# EasyEDA Pro project PCB工程文件(使用专业版立创EDA导入).epro

# Schematic rydog
Board Name: RYDOG; Create Date: 2024-09-16; Page Name: P1; Project Name: RY-DOG V2.0; Schematic Name: rydog; Update Date: 2024-10-09; Company: 嘉立创EDA; Page Size: A3; Version: V2.0
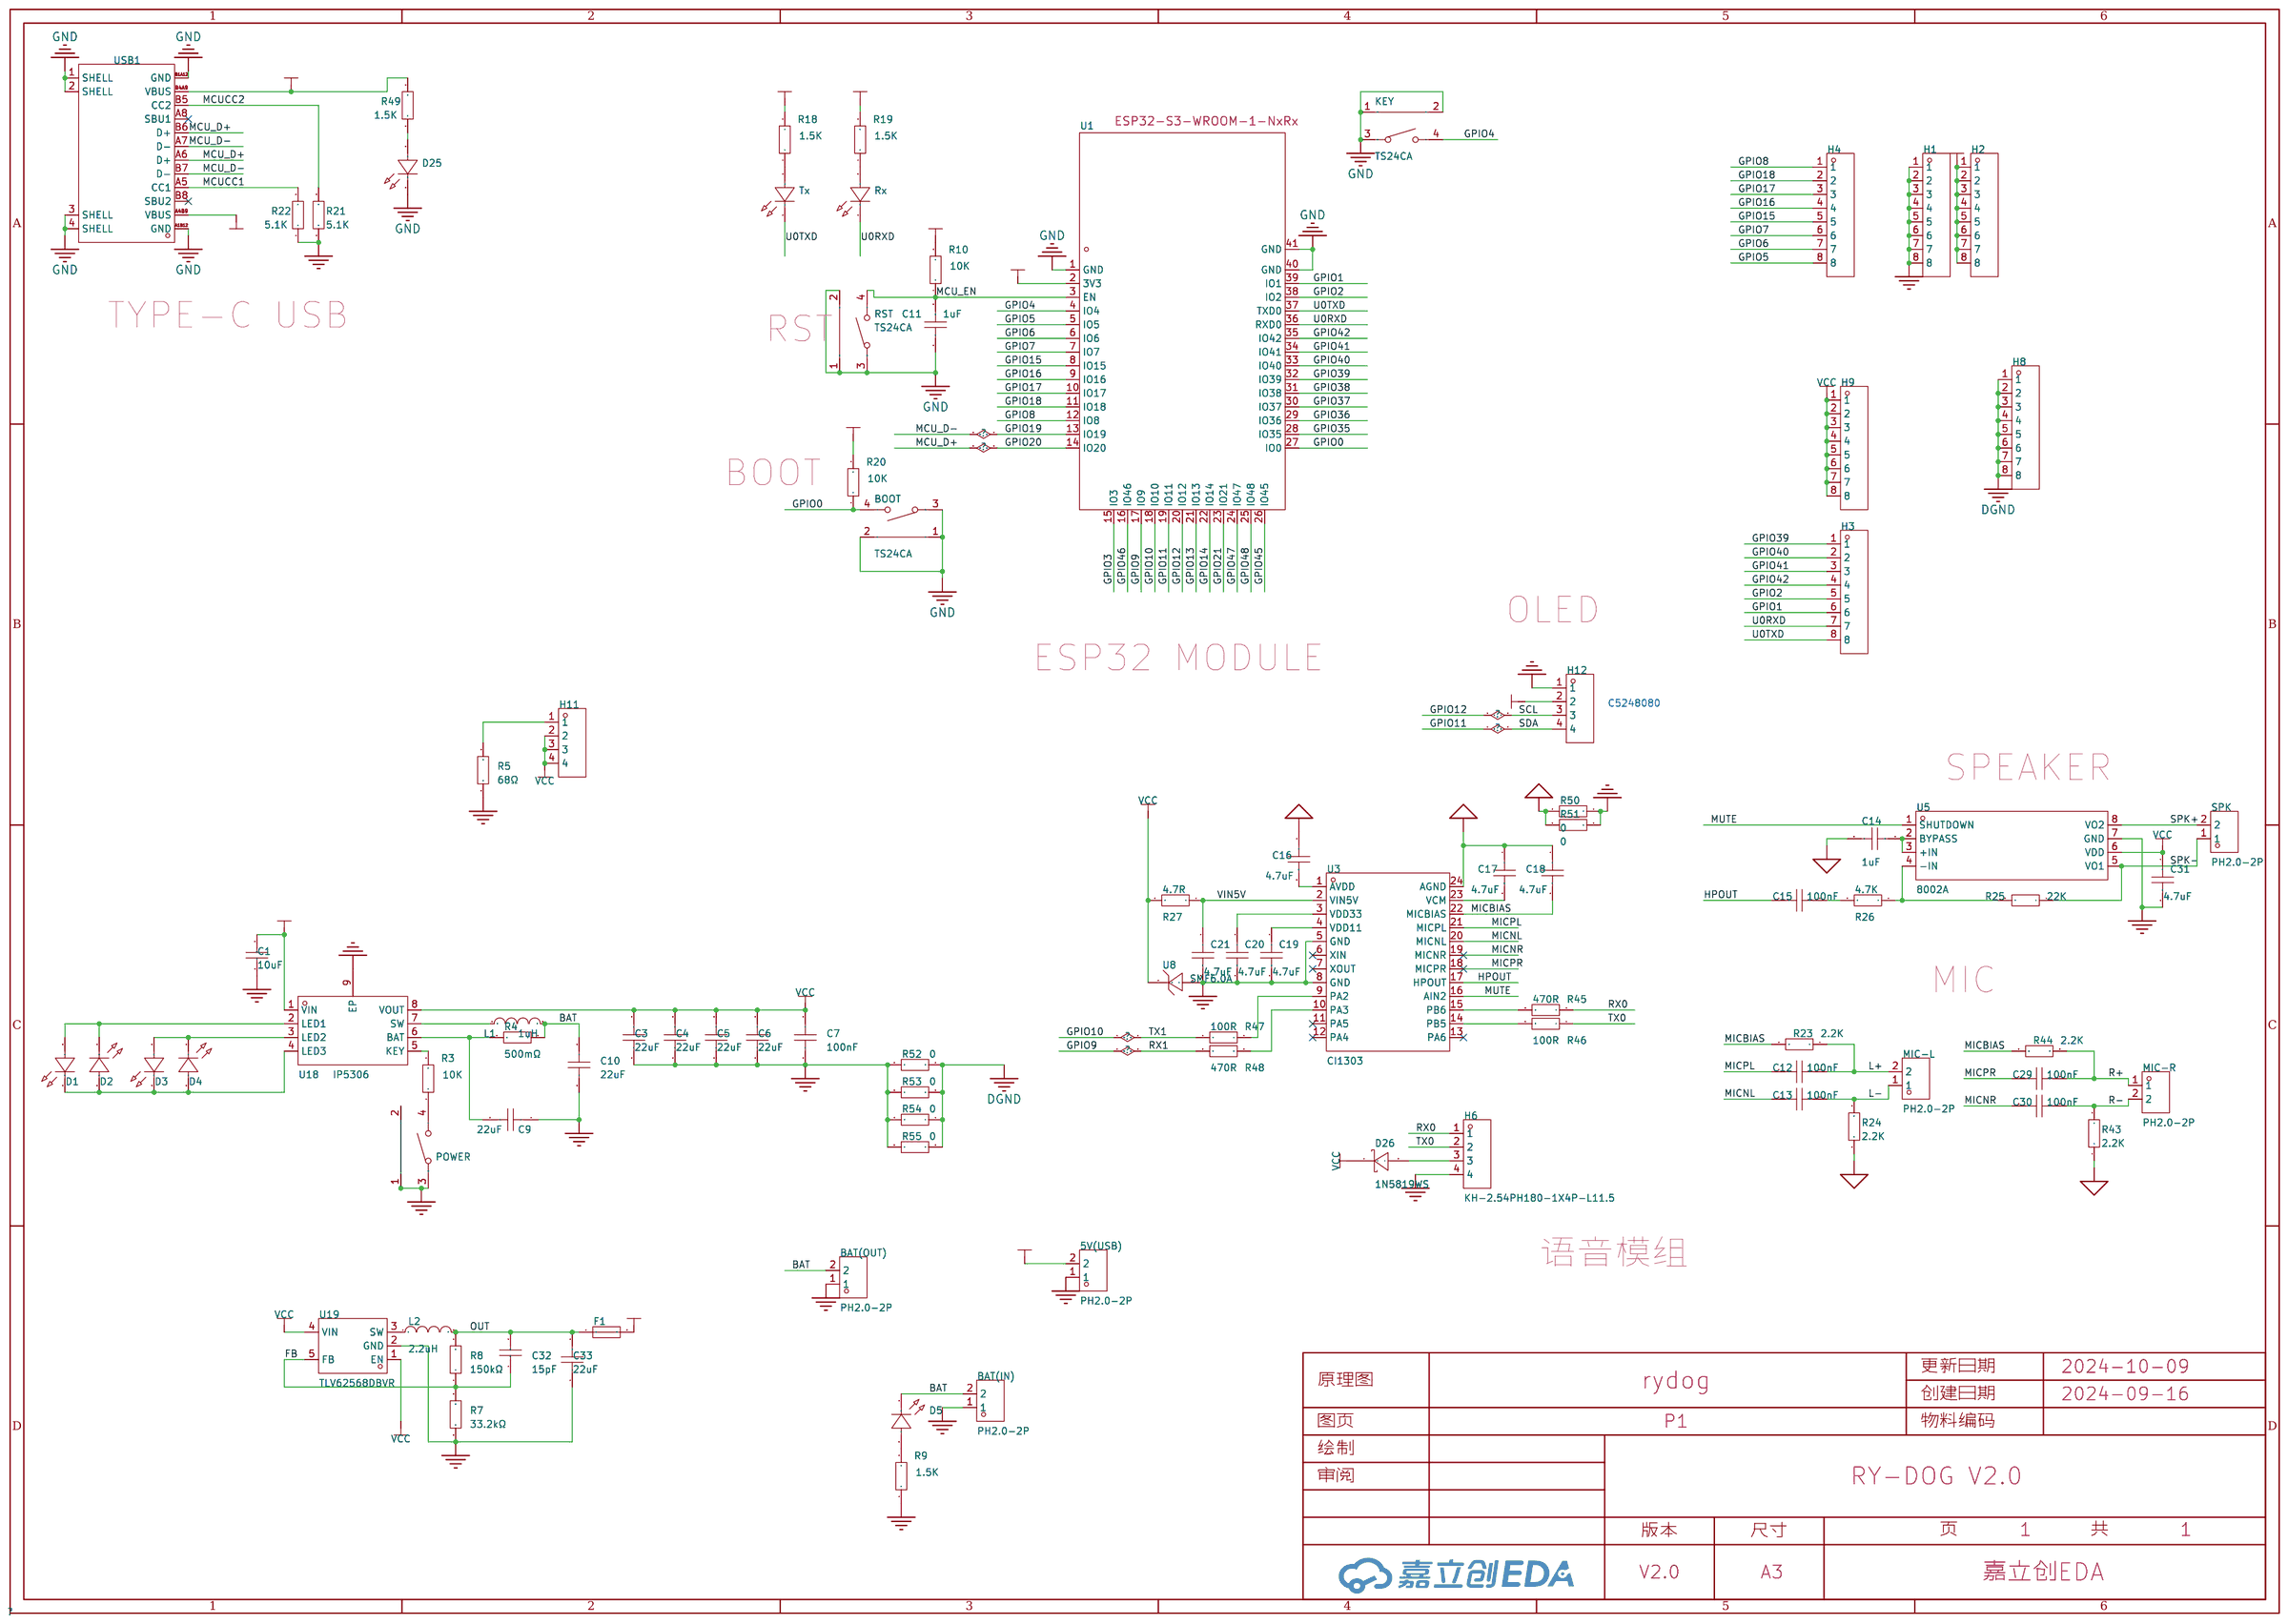
[diagram p0: schematic sheet]

## Parts
5V(USB)  PH2.0-2P  [CONN-TH_2P-P2.00_BOSSIE_BX-PH2.0-2PZZ]
BAT(IN)  PH2.0-2P  [CONN-TH_2P-P2.00_BOSSIE_BX-PH2.0-2PZZ]
BAT(OUT)  PH2.0-2P  [CONN-TH_2P-P2.00_BOSSIE_BX-PH2.0-2PZZ]
BOOT  TS24CA  [SW-SMD_TS24CA]
C1  10uF  [C0805]
C3  22uF  [C0805]
C4  22uF  [C0805]
C5  22uF  [C0805]
C6  22uF  [C0805]
C7  100nF  [C0603]
C9  22uF  [C0805]
C10  22uF  [C0805]
C11  1uF  [C0603]
C12  100nF  [C0603]
C13  100nF  [C0603]
C14  1uF  [C0603]
C15  100nF  [C0603]
C16  4.7uF  [C0603]
C17  4.7uF  [C0603]
C18  4.7uF  [C0603]
C19  4.7uF  [C0603]
C20  4.7uF  [C0603]
C21  4.7uF  [C0603]
C29  100nF  [C0603]
C30  100nF  [C0603]
C31  4.7uF  [C0603]
C32  15pF  [C0603]
C33  22uF  [C0805]
D1  XL-1608UGC-04  [LED0603-RD_GREEN]
D2  XL-1608UGC-04  [LED0603-RD_GREEN]
D3  XL-1608UGC-04  [LED0603-RD_GREEN]
D4  XL-1608UGC-04  [LED0603-RD_GREEN]
D5  XL-1608UGC-04  [LED0603-RD_GREEN]
D25  XL-1608UGC-04  [LED0603-RD_GREEN]
D26  1N5819WS  [SOD-323_L1.8-W1.3-LS2.5-RD]
F1  BSMD0805-100-6V  [F0805]
H1  PZ254V-11-08P  [HDR-TH_8P-P2.54-V-M]
H2  PZ254V-11-08P  [HDR-TH_8P-P2.54-V-M]
H3  PZ254V-11-08P  [HDR-TH_8P-P2.54-V-M]
H4  PZ254V-11-08P  [HDR-TH_8P-P2.54-V-M]
H6  KH-2.54PH180-1X4P-L11.5  [HDR-TH_4P-P2.54-V-M]
H8  PZ254V-11-08P  [HDR-TH_8P-P2.54-V-M]
H9  PZ254V-11-08P  [HDR-TH_8P-P2.54-V-M]
H11  KH-2.54PH180-1X4P-L11.5  [HDR-TH_4P-P2.54-V-M]
H12  KH-2.54PH180-1X4P-L11.5  [HDR-TH_4P-P2.54-V-M]
KEY  TS24CA  [SW-SMD_TS24CA]
L1  1uH  [IND-SMD_L4.4-W4.2]
L2  2.2uH  [L1008]
MIC-L  PH2.0-2P  [CONN-TH_2P-P2.00_BOSSIE_BX-PH2.0-2PZZ]
MIC-R  PH2.0-2P  [CONN-TH_2P-P2.00_BOSSIE_BX-PH2.0-2PZZ]
POWER  TS24CA  [SW-SMD_TS24CA]
R3  10K  [R0603]
R4  500mΩ  [R0603]
R5  68Ω  [R1210]
R7  33.2kΩ  [R0603]
R8  150kΩ  [R0603]
R9  1.5K  [R0603]
R10  10K  [R0603]
R18  1.5K  [R0603]
R19  1.5K  [R0603]
R20  10K  [R0603]
R21  5.1K  [R0603]
R22  5.1K  [R0603]
R23  2.2K  [R0603]
R24  2.2K  [R0603]
R25  22K  [R0603]
R26  4.7K  [R0603]
R27  4.7R  [R0603]
R43  2.2K  [R0603]
R44  2.2K  [R0603]
R45  470R  [R0603]
R46  100R  [R0603]
R47  100R  [R0603]
R48  470R  [R0603]
R49  1.5K  [R0603]
R50  0  [R0603]
R51  0  [R0603]
R52  0  [R0603]
R53  0  [R0603]
R54  0  [R0603]
R55  0  [R0603]
RST  TS24CA  [SW-SMD_TS24CA]
Rx  XL-1608UGC-04  [LED0603-RD_GREEN]
SPK  PH2.0-2P  [CONN-TH_2P-P2.00_BOSSIE_BX-PH2.0-2PZZ]
Tx  XL-1608UGC-04  [LED0603-RD_GREEN]
U1  ESP32-S3-WROOM-1(N16R8)  [WIRELM-SMD_ESP32-S3-WROOM-1]
U3  CI1303  [SSOP-24_L8.6-W3.9-P0.64-LS6.0-BL]
U5  8002A  [SOP-8_L4.9-W3.9-P1.27-LS6.0-BL]
U8  SMF6.0A  [SOD-123FL_L2.8-W1.8-LS3.8-RD]
U18  IP5306  [ESOP-8_L4.9-W3.9-P1.27-LS6.0-BL-EP]
U19  TLV62568DBVR  [SOT-23-5_L3.0-W1.7-P0.95-LS2.8-BR]
USB1  -  [USB-C-SMD_G-SWITCH_GT-USB-7010EN]

## Library data of the parts
5V(USB) BAT(IN) BAT(OUT) MIC-L MIC-R SPK = PH2.0-2P: Supplier Part: C9900095162; JLCPCB Part Class: 扩展库; Supplier: LCSC
BOOT KEY POWER RST = TS24CA: 电路结构:单刀单掷;按钮形状:矩形按钮;安装方式:卧贴;开关长度:4.55mm;开关宽度:1.8mm;开关高度:3.5mm;触点电流:50mA;额定电压(DC):12V;带灯:-;机械寿命:-;; LCSC Part Name: 4.55*1.8*3.5mm 卧贴 轻触开关; Supplier Part: C393942; Manufacturer: SHOU HAN(首韩); Supplier Footprint: SMD; JLCPCB Part Class: 扩展库; Datasheet: https://atta.szlcsc.com/upload/public/pdf/source/20190521/C393942_591A9E318887EFA4274D34029981AD99.pdf; Supplier: LCSC; Circuit: 单刀单掷; Actuator Style: 矩形按钮; Mounting Style: 卧贴; Switch Length: 4.55mm; Switch Width: 1.8mm; Switch Height: 3.5mm; Contact Current: 50mA; Voltage Rating (DC): 12V
C1 = CL21A106KPFNNNE: 容值:10uF;精度:±10%;额定电压:10V;材质(温度系数):X5R;; LCSC Part Name: 10uF ±10% 10V; Supplier Part: C17024; Manufacturer: SAMSUNG(三星); Supplier Footprint: 0805; Datasheet: https://atta.szlcsc.com/upload/public/pdf/source/20160218/1457707763339.pdf; Supplier: LCSC; Tolerance: ±10%; Voltage Rated: 10V; Temperature Coefficient: X5R
C3-C6 C9 C10 C33 = CGA0805X5R226M350MT: 容值:22uF;精度:±20%;额定电压:35V;材质(温度系数):X5R;; LCSC Part Name: 22uF ±20% 35V; Supplier Part: C6119901; Manufacturer: HRE(芯声); Supplier Footprint: 0805; Datasheet: https://atta.szlcsc.com/upload/public/pdf/source/20231129/D589D0CC4D260F7AC3A77E53B455CCB3.pdf; Supplier: LCSC; Tolerance: ±20%; Voltage Rated: 35V; Temperature Coefficient: X5R
C7 = CC0603KRX7R9BB104: 容值:100nF;精度:±10%;额定电压:50V;材质(温度系数):X7R;; LCSC Part Name: 100nF ±10% 50V; Supplier Part: C14663; Manufacturer: YAGEO(国巨); Supplier Footprint: 0603; Datasheet: https://atta.szlcsc.com/upload/public/pdf/source/20180910/C282072_33301C7F631E79921B82A8DAC6BCC5B3.pdf; Supplier: LCSC; Tolerance: ±10%; Voltage Rated: 50V; Temperature Coefficient: X7R
C11-C21 C29-C31 = CC0603KRX7R9BB104: 容值:100nF;精度:±10%;额定电压:50V;材质(温度系数):X7R;; LCSC Part Name: 100nF ±10% 50V; Supplier Part: C14663; Manufacturer: YAGEO(国巨); Supplier Footprint: 0603; JLCPCB Part Class: Basic Part; Datasheet: https://atta.szlcsc.com/upload/public/pdf/source/20170116/1484561234239.pdf; Supplier: LCSC; Tolerance: ±10%; Voltage Rated: 50V; Temperature Coefficient: X7R
C32 = CC0603JRNPO9BN150: 容值:15pF;精度:±5%;额定电压:50V;材质(温度系数):NP0;; LCSC Part Name: 15pF ±5% 50V; Supplier Part: C107037; Manufacturer: YAGEO(国巨); Supplier Footprint: 0603; Datasheet: https://atta.szlcsc.com/upload/public/pdf/source/20170914/C128857_1505359892143968080.pdf; Supplier: LCSC; Tolerance: ±5%; Voltage Rated: 50V; Temperature Coefficient: NP0
D1-D5 D25 Rx Tx = XL-1608UGC-04: 灯头类型:-;发光颜色:翠绿色;正向电压(VF):-;功率:80mW;正向电流:25mA;主波长:516nm~525nm;二极管配置:独立二极管;透镜颜色:无色透明透镜;色温:-;发光强度:-;发光角度:120°;载带方式:正贴;工作温度:-30℃~+85℃;; Supplier Part: C965804; Manufacturer: XINGLIGHT(成兴光); Supplier Footprint: 0603; Datasheet: https://atta.szlcsc.com/upload/public/pdf/source/20221102/520D6E465E5CFD1609C8A4DBC80D4018.pdf; Supplier: LCSC; Emitted Color: 翠绿色; Power Dissipation: 80mW; Forward Current: 25mA; Dominant Wavelength: 516nm~525nm; Peak Wavelength: 534nm; Diode Configuration: 独立二极管; Lens Color: 无色透明透镜; Viewing Angle: 120°; Mounting Sytle: 正贴; Operating Temperature: -30℃~+85℃
D26 = 1N5819WS_C191023: 正向压降(Vf):600mV@1A;直流反向耐压(Vr):40V;平均整流电流(Io):1A;; LCSC Part Name: 电压:40V 电流:1A; Supplier Part: C191023; Manufacturer: Hottech(合科泰); Supplier Footprint: SOD-323; JLCPCB Part Class: 基础库; Datasheet: https://atta.szlcsc.com/upload/public/pdf/source/20220428/3CB86FD8D28D653594B4E35F9D5AEFD9.pdf; Supplier: LCSC; Forward Voltage (Vf@If): 600mV@1A; Reverse Voltage (Vr): 40V; Average Rectified Current (Io): 1A
F1 = BSMD0805-100-6V: 最大电压:6V;最大电流:40A;保持电流:1A;跳闸电流:2A;; LCSC Part Name: 6V 1A 0805自恢复; Supplier Part: C883112; Manufacturer: BHFUSE(佰宏); Supplier Footprint: 0805; Datasheet: https://atta.szlcsc.com/upload/public/pdf/source/20230512/7A46D6CD923C15CBB98FD769C08EDD80.pdf; Supplier: LCSC; Operating Voltage (Max): 6V; Current Rating (Max): 40A; Hold Current: 1A; Trip Current: 2A; Power Dissipation: 600mW; Resistance - Initial (Ri) (Min): 40mΩ; Resistance - Post Trip (R1) (Max): 270mΩ; Maximum Time to Trip: 300ms; Operating Temperature: -40℃~+85℃
H1-H4 H8 H9 = PZ254V-11-08P: 插针结构:1x8P;间距:2.54mm;行距:-;圆针/方针:方针;安装类型:直插;排数:单排;总PIN位数:8P;额定电流:-;额定电压:-;配合针长度:6mm;塑高:2.5mm;端接针长度:3mm;触头材质:黄铜;触头镀层:-;工作温度范围:-40℃~+105℃;颜色:黑色;; LCSC Part Name: 间距:2.54mm 1x8P 直插 方针; Supplier Part: C492407; Manufacturer: XFCN(兴飞); Supplier Footprint: 插件,P=2.54mm; JLCPCB Part Class: 扩展库; Datasheet: https://atta.szlcsc.com/upload/public/pdf/source/20200309/C492407_83A6FB26A2233368EDB9516968EC6149.pdf; Supplier: LCSC; Pin Structure: 1x8P; Pitch: 2.54mm; Circluar Pins/Square Pins: 方针; Mounting Type: 直插; Number of Rows: 单排; Number of Pins: 8P; Length of Mating Pin: 6mm; Insulation Height: 2.5mm; Length of End Connection Pin: 3mm; Contact Material: 黄铜; Operating Temperature Range: -40℃~+105℃; Color: 黑色
H6 H11 H12 = KH-2.54PH180-1X4P-L11.5: 排数:单排;总PIN位数:4P;间距:2.54mm;插针结构:1x4P;行距:-;安装类型:直插;圆针/方针:方针;额定电流:3A;额定电压:-;配合针长度:6mm;塑高:2.5mm;端接针长度:3mm;触头材质:-;工作温度范围:-40℃~+105℃;颜色:黑色;; Supplier: LCSC; Supplier Part: C2905435; Manufacturer: kinghelm(金航标); LCSC Part Name: 2.54mm 1x4P 直插 方针; Supplier Footprint: 插件,P=2.54mm; Datasheet: https://atta.szlcsc.com/upload/public/pdf/source/20211019/06FD9EA041E66F176E900F61FE678D35.pdf; Number of Rows: 单排; Number of Pins: 4P; Pitch: 2.54mm; Pin Structure: 1x4P; Mounting Type: 直插; Circluar Pins/Square Pins: 方针; Current Rating (Max): 3A; Length of Mating Pin: 6mm; Insulation Height: 2.5mm; Length of End Connection Pin: 3mm; Operating Temperature Range: -40℃~+105℃; Color: 黑色
L1 = FXL0420-1R0-M: 电感值:1uH;精度:±20%;额定电流:6A;饱和电流(Isat):7A;类型:一体成型电感;; LCSC Part Name: 1uH ±20% 7A; Supplier Part: C167203; Manufacturer: cjiang(长江微电); Supplier Footprint: SMD,4.2x4.4mm; Datasheet: https://atta.szlcsc.com/upload/public/pdf/source/20240426/3189EA8206330E2108542F9E34E540E7.pdf; Supplier: LCSC; Tolerance: ±20%; Rated Current: 6A; Saturation Current (Isat): 7A; DC Resistance (DCR): 27mΩ; Type: 一体成型电感
L2 = SLM25202R2MIT: 电感值:2.2uH;精度:±20%;额定电流:1.2A;; LCSC Part Name: 2.2uH ±20%; Supplier Part: C216158; Manufacturer: Sunltech(韩国顺磁); Supplier Footprint: 1008; Datasheet: https://atta.szlcsc.com/upload/public/pdf/source/20180528/C216156_746607D01E5EB4C50E0D2BE40685D2FE.pdf; Supplier: LCSC; Tolerance: ±20%; Rated Current: 1.2A; DC Resistance (DCR): 80mΩ
R3 R9 R10 R18-R27 R43-R55 = TR0603B10K0P0525Z: 电阻类型:薄膜电阻;阻值:10kΩ;精度:±0.1%;功率:100mW;温度系数:±25ppm/;最大工作电压:75V;工作温度范围:-55~+155;; LCSC Part Name: 10kΩ ±0.1% 100mW; Supplier Part: C188363; Manufacturer: EVER OHMS(天二科技); Supplier Footprint: 0603; JLCPCB Part Class: Extended Part; Datasheet: https://atta.szlcsc.com/upload/public/pdf/source/20190415/C188363_433BF05B6FB8F7A0F5F35A3E4390C55A.pdf; Supplier: LCSC; Type: 薄膜电阻; Tolerance: ±0.1%; Power(Watts): 100mW; Temperature Coefficient: ±25ppm/; Overload Voltage (Max): 75V; Operating Temperature Range: -55~+155
R4 = 0603WAF500LT5E: 电阻类型:厚膜电阻;阻值:500mΩ;精度:±1%;功率:100mW;最大工作电压:75V;温度系数:±800ppm/℃;; LCSC Part Name: 500mΩ ±1% 100mW 厚膜电阻; Supplier Part: C45312; Manufacturer: UNI-ROYAL(厚声); Supplier Footprint: 0603; Datasheet: https://atta.szlcsc.com/upload/public/pdf/source/20200306/C422600_1E6D84923E4A46A82E41ADD87F860B5C.pdf; Supplier: LCSC; Type: 厚膜电阻; Tolerance: ±1%; Power(Watts): 100mW; Overload Voltage (Max): 75V; Temperature Coefficient: ±800ppm/℃; Operating Temperature Range: -55℃~+155℃
R5 = RC1210JR-0768RL: 电阻类型:厚膜电阻;阻值:68Ω;精度:±5%;功率:500mW;最大工作电压:200V;温度系数:±100ppm/℃;; LCSC Part Name: 厚膜电阻 68Ω ±5% 500mW; Supplier Part: C326891; Manufacturer: YAGEO(国巨); Supplier Footprint: 1210; Datasheet: https://atta.szlcsc.com/upload/public/pdf/source/20181031/C326891_95FC753AC72FE33F33A4E47C229D1250.pdf; Supplier: LCSC; Type: 厚膜电阻; Tolerance: ±5%; Power(Watts): 500mW; Overload Voltage (Max): 200V; Temperature Coefficient: ±100ppm/℃; Operating Temperature Range: -55℃~+155℃
R7 = 0603WAF3322T5E: 电阻类型:厚膜电阻;阻值:33.2kΩ;精度:±1%;功率:100mW;最大工作电压:75V;温度系数:±100ppm/℃;; LCSC Part Name: 33.2kΩ ±1% 100mW 厚膜电阻; Supplier Part: C23003; Manufacturer: UNI-ROYAL(厚声); Supplier Footprint: 0603; Datasheet: https://atta.szlcsc.com/upload/public/pdf/source/20200306/C422600_1E6D84923E4A46A82E41ADD87F860B5C.pdf; Supplier: LCSC; Type: 厚膜电阻; Tolerance: ±1%; Power(Watts): 100mW; Overload Voltage (Max): 75V; Temperature Coefficient: ±100ppm/℃; Operating Temperature Range: -55℃~+155℃
R8 = 0603WAF1503T5E: 电阻类型:厚膜电阻;阻值:150kΩ;精度:±1%;功率:100mW;最大工作电压:75V;温度系数:±100ppm/℃;; LCSC Part Name: 150kΩ ±1% 100mW 厚膜电阻; Supplier Part: C22807; Manufacturer: UNI-ROYAL(厚声); Supplier Footprint: 0603; Datasheet: https://atta.szlcsc.com/upload/public/pdf/source/20200306/C422600_1E6D84923E4A46A82E41ADD87F860B5C.pdf; Supplier: LCSC; Type: 厚膜电阻; Tolerance: ±1%; Power(Watts): 100mW; Overload Voltage (Max): 75V; Temperature Coefficient: ±100ppm/℃; Operating Temperature Range: -55℃~+155℃
U1 = ESP32-S3-WROOM-1(N16R8): LCSC Part Name: ESP32-S3-WROOM-1-NxRx; Supplier Part: C2913202; Manufacturer: ESPRESSIF(乐鑫); Supplier Footprint: ESP32-S3R8; JLCPCB Part Class: 扩展库; Datasheet: https://atta.szlcsc.com/upload/public/pdf/source/20220705/4E799F39581577F766659887F738A439.pdf; Supplier: LCSC
U3 = CI1303: CPU内核:RISC;程序存储容量:4MB;RAM总容量:640KB;GPIO端口数量:10;工作电压范围:3.6V~5.5V;CPU最大主频:220MHz;程序存储器类型:FLASH;; LCSC Part Name: 高抗噪离线智能语音识别芯片（支持离线NLP，命令词自学习）; Supplier Part: C5181796; Manufacturer: Chiplntelli(启英泰伦); Supplier Footprint: SSOP-24; JLCPCB Part Class: 扩展库; Datasheet: https://atta.szlcsc.com/upload/public/pdf/source/20221017/92DAF78018487B606B968ECE054D00EE.pdf; Supplier: LCSC; CPU Core: RISC; Program Storage Size: 4MB; RAM Size: 640KB; GPIO Ports Number: 10; Operating Voltage Range: 3.6V~5.5V; CPU Maximum Speed: 220MHz; Program Memory Type: FLASH; Operating Temperature Range: -40℃~+85℃; ADC (Bit): 12bit; UART/USART: 3; I2C: 1; I2S: 1
U5 = 8002A: 功放类型:-;扬声器通道数:单声道;输出功率:3Wx1@4Ω;静态电流(Iq):-;; Supplier Part: C329448; Manufacturer: IDCHIP(英锐芯); Supplier Footprint: SOP-8; JLCPCB Part Class: 扩展库; Datasheet: https://atta.szlcsc.com/upload/public/pdf/source/20190322/C329448_5EF9C50C87CEA30F05517486CD56551D.pdf; Supplier: LCSC; Speaker Channels: 单声道; Output Power: 3Wx1@4Ω; Supply Voltage: 2.2V~5.5V
U8 = SMF6.0A: 反向截止电压(Vrwm):6V;最大钳位电压:10.3V;峰值脉冲电流(Ipp)@10/1000us:19.4A;峰值脉冲功率(Ppp)@10/1000us:200W;击穿电压:6.67V;; Supplier Part: C2980406; Manufacturer: GOODWORK(固得沃克); Supplier Footprint: SOD-123FL; Datasheet: https://atta.szlcsc.com/upload/public/pdf/source/20220309/7587E0D41D3B50523D05600E630D0EDF.pdf; Supplier: LCSC; Reverse Stand-Off Voltage (Vrwm): 6V; Maximum Clamping Voltage: 10.3V; Peak Pulse Current (Ipp)@10/1000us: 19.4A; Peak Pulse Power Dissipation (Ppp)@10/1000us: 200W; Breakdown Voltage: 6.67V; Reverse Leakage Current (Ir): 400uA; Type: TVS
U18 = IP5306: 2.1A充电2.4A放电高集成度移动电源SOC; Supplier Part: C181692; Manufacturer: INJOINIC(英集芯); Supplier Footprint: ESOP-8; JLCPCB Part Class: 扩展库; Datasheet: https://atta.szlcsc.com/upload/public/pdf/source/20190627/C384572_9925B3DDC4041BC6108E5AB46A2A0AB1.pdf; Supplier: LCSC
U19 = TLV62568DBVR: 功能类型:降压型;输出类型:可调;输入电压:2.5V~5.5V;输出电压:600mV~5.5V;输出电流(最大值):1A;; Supplier Part: C163219; Manufacturer: TI(德州仪器); Supplier Footprint: SOT-23-5; Datasheet: https://www.ti.com/cn/lit/gpn/tlv62568; Supplier: LCSC; Function: 降压型; Output Type: 可调; Input Voltage: 2.5V~5.5V; Output Voltage: 600mV~5.5V; Output Current (Max): 1A; Switching Frequency: 1.5MHz; Operating Temperature: -40℃~+125℃@(TJ); Synchronous Rectification: 是; Number of Outputs: 1; Topology: 降压式; Switch tube (built-in/external): 内置
USB1 = HC-TYPE-C-16P-01A-R: 连接器类型:Type-C;公母:母座;触点数量:16;端口数量:1;安装方式:卧贴;; LCSC Part Name: Type-C 母座 卧贴; Supplier Part: C2997433; Manufacturer: HCTL(华灿天禄); Supplier Footprint: SMD; Datasheet: https://atta.szlcsc.com/upload/public/pdf/source/20220415/23B51DCADC5F28223C40C3605487ACA1.pdf; Supplier: LCSC; Connector Type: Type-C; Gender: 母座; Number of Contacts: 16; Number of Ports: 1; Mounting Style: 卧贴

## Nets
3V3: F1.2 H2.1 H2.2 H2.3 H2.4 H2.5 H2.6 H2.7 H2.8 H12.2 R10.2 R18.2 R19.2 R20.2 U1.2(3V3)
+5V_USB: 5V(USB).2 C1.2 R49.1 U18.1(VIN) USB1.A4B9(VBUS) USB1.B4A9(VBUS)
AGND: C14.2 C16.1 C17.1 C18.1 R24.1 R43.1 R50.2 R51.2 U3.24(AGND)
DGND: H8.1 H8.2 H8.3 H8.4 H8.5 H8.6 H8.7 H8.8 R52.1 R53.1 R54.1 R55.1
GND: 5V(USB).1 BAT(IN).1 BAT(OUT).1 BOOT.1 BOOT.2 BOOT.3 C1.1 C3.1 C4.1 C5.1 C6.1 C7.1 C9.1 C10.1 C11.1 C19.2 C20.2 C21.2 C31.2 C33.1 D25.1(K) H1.1 H1.2 H1.3 H1.4 H1.5 H1.6 H1.7 H1.8 H6.4 H12.1 KEY.1 KEY.2 KEY.3 POWER.1 POWER.2 POWER.3 R5.1 R7.1 R9.1 R21.1 R22.1 R50.1 R51.1 R52.2 R53.2 R54.2 R55.2 RST.1 RST.2 RST.3 U1.1(GND) U1.40(GND) U1.41(GND) U3.5(GND) U3.8(GND) U5.7(GND) U8.2(A) U18.9(EP) U19.2(GND) USB1.1(SHELL) USB1.2(SHELL) USB1.3(SHELL) USB1.4(SHELL) USB1.A1B12(GND) USB1.B1A12(GND)
VCC: C3.2 C4.2 C5.2 C6.2 C7.2 C31.1 D26.1(K) H9.1 H9.2 H9.3 H9.4 H9.5 H9.6 H9.7 H9.8 H11.2 H11.3 H11.4 R27.2 U5.6(VDD) U8.1(C) U18.8(VOUT) U19.1(EN) U19.4(VIN)
VIN5V: C21.1 R27.1 U3.2(VIN5V)
BAT: BAT(IN).2 BAT(OUT).2 C10.2 D5.1(K) L1.2 R4.1
FB: C32.1 R7.2 R8.1 U19.5(FB)
GPIO0: BOOT.4 R20.1 U1.27(IO0)
GPIO1: H3.6 U1.39(IO1)
GPIO2: H3.5 U1.38(IO2)
GPIO3: U1.15(IO3)
GPIO4: KEY.4 U1.4(IO4)
GPIO5: H4.8 U1.5(IO5)
GPIO6: H4.7 U1.6(IO6)
GPIO7: H4.6 U1.7(IO7)
GPIO8: H4.1 U1.12(IO8)
GPIO9: R48.2 U1.17(IO9)
GPIO10: R47.2 U1.18(IO10)
GPIO11: H12.4 U1.19(IO11)
GPIO12: H12.3 U1.20(IO12)
GPIO13: U1.21(IO13)
GPIO14: U1.22(IO14)
GPIO15: H4.5 U1.8(IO15)
GPIO16: H4.4 U1.9(IO16)
GPIO17: H4.3 U1.10(IO17)
GPIO18: H4.2 U1.11(IO18)
GPIO19: U1.13(IO19) USB1.A7(D-) USB1.B7(D-)
GPIO20: U1.14(IO20) USB1.A6(D+) USB1.B6(D+)
GPIO21: U1.23(IO21)
GPIO35: U1.28(IO35)
GPIO36: U1.29(IO36)
GPIO37: U1.30(IO37)
GPIO38: U1.31(IO38)
GPIO39: H3.1 U1.32(IO39)
GPIO40: H3.2 U1.33(IO40)
GPIO41: H3.3 U1.34(IO41)
GPIO42: H3.4 U1.35(IO42)
GPIO45: U1.26(IO45)
GPIO46: U1.16(IO46)
GPIO47: U1.24(IO47)
GPIO48: U1.25(IO48)
HPOUT: C15.1 U3.17(HPOUT)
L+: C12.2 MIC-L.2 R23.1
L-: C13.2 MIC-L.1 R24.2
MCU_EN: C11.2 R10.1 RST.4 U1.3(EN)
MCUCC1: R22.2 USB1.A5(CC1)
MCUCC2: R21.2 USB1.B5(CC2)
MICBIAS: C18.2 R23.2 R44.2 U3.22(MICBIAS)
MICNL: C13.1 U3.20(MICNL)
MICNR: C30.1 U3.19(MICNR)
MICPL: C12.1 U3.21(MICPL)
MICPR: C29.1 U3.18(MICPR)
MUTE: U3.16(AIN2) U5.1(SHUTDOWN)
OUT: C32.2 C33.2 F1.1 L2.2 R8.2
R+: C29.2 MIC-R.1 R44.1
R-: C30.2 MIC-R.2 R43.2
RX0: H6.1 R45.1
SPK+: SPK.2 U5.8(VO2)
SPK-: R25.1 SPK.1 U5.5(VO1)
TX0: H6.2 R46.1
U0RXD: H3.7 Rx.1(K) U1.36(RXD0)
U0TXD: H3.8 Tx.1(K) U1.37(TXD0)
$1N2534: C14.1 U5.2(BYPASS) U5.3(+IN)
$1N2536: R25.2 R26.1 U5.4(-IN)
$1N2540: C15.2 R26.2
$1N2554: C16.2 U3.1(AVDD)
$1N2563: C17.2 U3.23(VCM)
$1N2581: R45.2 U3.15(PB6)
$1N2584: R46.2 U3.14(PB5)
$1N2587: R47.1 U3.9(PA2)
$1N2590: R48.1 U3.10(PA3)
$1N2601: C19.1 U3.4(VDD11)
$1N2603: C20.1 U3.3(VDD33)
$1N27240: D25.2(A) R49.2
$1N94139: C9.2 R4.2 U18.6(BAT)
$1N94140: L1.1 U18.7(SW)
$1N94145: D1.1(K) D2.2(A) D3.1(K) D4.2(A) U18.4(LED3)
$1N94146: D1.2(A) D2.1(K) U18.2(LED1)
$1N94147: D3.2(A) D4.1(K) U18.3(LED2)
$1N94153: H11.1 R5.2
$1N94156: L2.1 U19.3(SW)
$1N94164: R3.2 U18.5(KEY)
$1N97678: R18.1 Tx.2(A)
$1N97724: R19.1 Rx.2(A)
$1N97763: POWER.4 R3.1
$1N97802: D5.2(A) R9.2
$1N103126: D26.2(A) H6.3

Not connected (* = marked no-connect by the designer): U3 6(XIN)* 7(XOUT)* 11(PA5)* 12(PA4)* 13(PA6)*; USB1 A8(SBU1)* B8(SBU2)*

## Notes on the sheet
- TYPE-C USB
- RST
- BOOT
- OLED
- ESP32 MODULE
- C5248080
- SPEAKER
- MIC
- 语音模组

# Board rydog
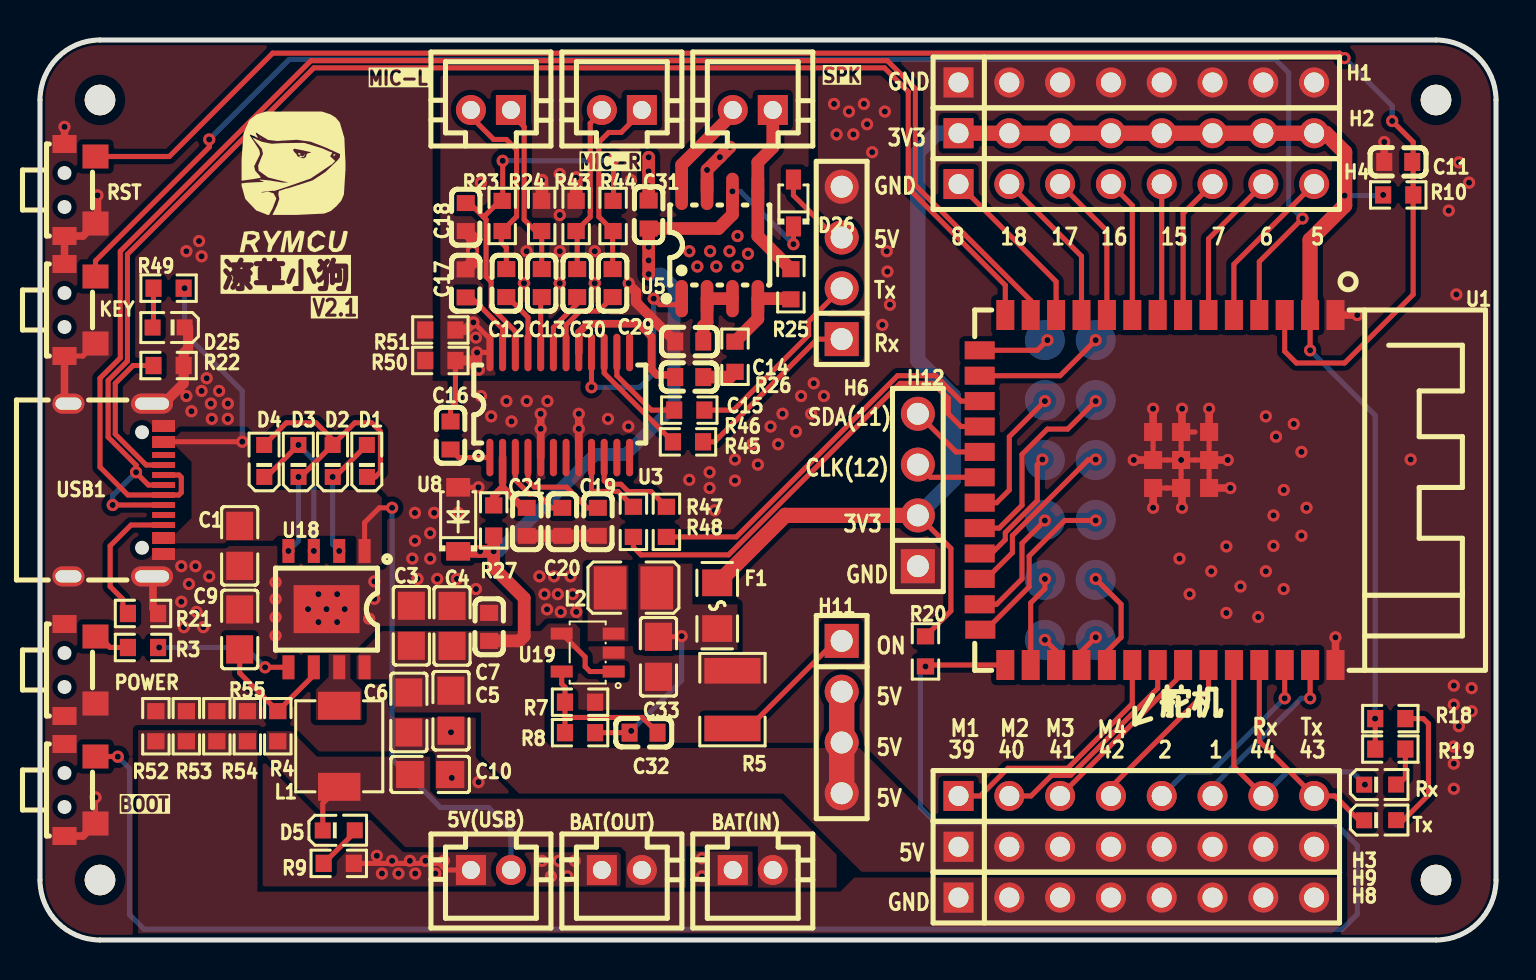
[diagram p1: board, top side]
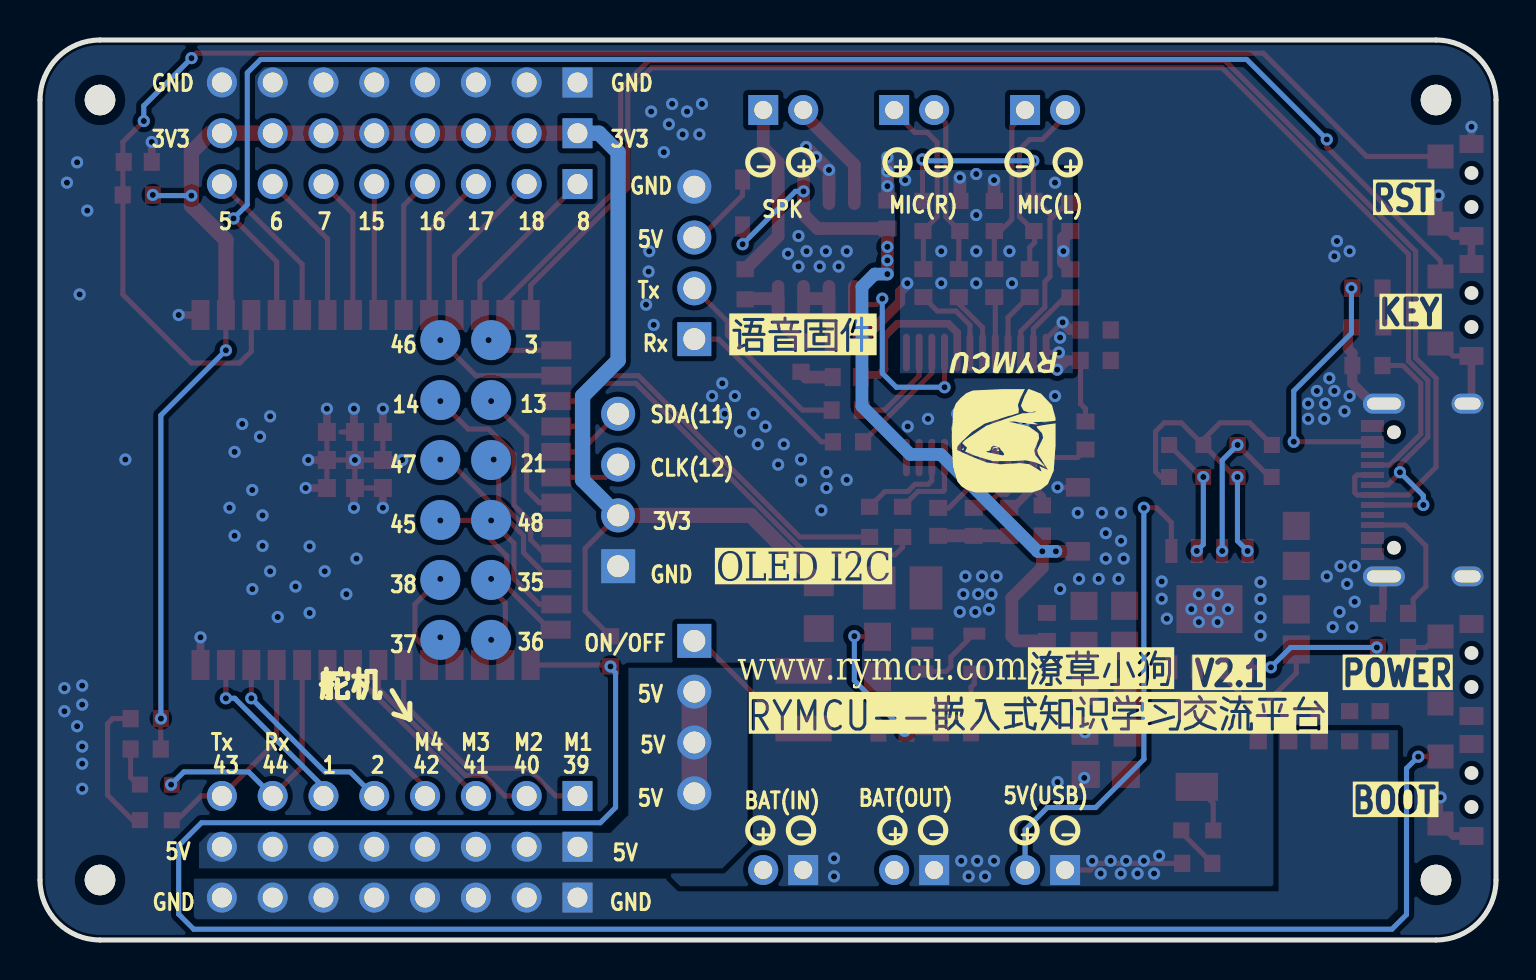
[diagram p2: board, bottom side, seen from below]

Outline 72.8 x 45 mm; copper layers: Top Layer, Bottom Layer. Coordinates in mm from the lower left corner of the outline.
Outline path: 0,42 arc(0.88,44.12) 3,45 69.8,45 arc(71.92,44.12) 72.8,42 72.8,3 arc(71.92,0.88) 69.8,0 3,0 arc(0.88,0.88) 0,3 0,42
Stack: Top Layer 0.035mm / Dielectric1 1.51mm FR4 er 4.5 / Bottom Layer 0.035mm

## Design rules (mm)
template: 自定义配置
spacing copperThickness1oz (default): track to track 0.102, other pairs 0.152 to 0.3
spacing copperThickness2oz: track to track 0.203, other pairs 0.152 to 0.3
track width copperThickness1oz (default): min 0.127, default 0.254, max 2.54
track width copperThickness2oz: min 0.203, default 0.254, max 2.54
differential pair differentialPair (default): width min 0.127, default 0.254, max 2.54; gap min 0.152, default 0.152
via viaSize (default): diameter min 0.5, default 0.61, max 10; hole min 0.3, default 0.305, max 6.3

## Placement (name value [footprint] x y rotation side)
5V(USB)  PH2.0-2P  [CONN-TH_2P-P2.00_BOSSIE_BX-PH2.0-2PZZ]  22.55 3.5 0 top
BAT(IN)  PH2.0-2P  [CONN-TH_2P-P2.00_BOSSIE_BX-PH2.0-2PZZ]  35.64 3.5 0 top
BAT(OUT)  PH2.0-2P  [CONN-TH_2P-P2.00_BOSSIE_BX-PH2.0-2PZZ]  29.09 3.5 0 top
BOOT  TS24CA  [SW-SMD_TS24CA]  2 7.5 90 top
C1  10uF  [C0805]  9.98 19.71 90 top
C3  22uF  [C0805]  18.57 15.71 270 top
C4  22uF  [C0805]  20.6 15.7 270 top
C5  22uF  [C0805]  20.55 11.46 90 top
C6  22uF  [C0805]  18.44 11.38 90 top
C7  100nF  [C0603]  22.45 15.66 270 top
C9  22uF  [C0805]  9.98 15.53 270 top
C10  22uF  [C0805]  19.51 8.28 180 top
C11  1uF  [C0603]  67.91 38.9 0 top
C12  100nF  [C0603]  23.31 32.84 90 top
C13  100nF  [C0603]  25.09 32.84 90 top
C14  1uF  [C0603]  32.46 29.92 180 top
C15  100nF  [C0603]  32.46 28.15 0 top
C16  4.7uF  [C0603]  20.53 25.22 270 top
C17  4.7uF  [C0603]  21.28 32.83 270 top
C18  4.7uF  [C0603]  21.29 36.15 90 top
C19  4.7uF  [C0603]  27.89 20.91 270 top
C20  4.7uF  [C0603]  26.11 20.91 270 top
C21  4.7uF  [C0603]  24.34 20.91 270 top
C29  100nF  [C0603]  28.63 32.84 90 top
C30  100nF  [C0603]  26.86 32.84 90 top
C31  4.7uF  [C0603]  30.43 36.27 90 top
C32  15pF  [C0603]  30.18 10.37 180 top
C33  22uF  [C0805]  30.92 14.16 90 top
D1  XL-1608UGC-04  [LED0603-RD_GREEN]  16.35 23.95 90 top
D2  XL-1608UGC-04  [LED0603-RD_GREEN]  14.63 23.95 90 top
D3  XL-1608UGC-04  [LED0603-RD_GREEN]  12.92 23.95 90 top
D4  XL-1608UGC-04  [LED0603-RD_GREEN]  11.21 23.95 90 top
D5  XL-1608UGC-04  [LED0603-RD_GREEN]  14.94 5.48 0 top
D25  XL-1608UGC-04  [LED0603-RD_GREEN]  6.43 30.63 180 top
D26  1N5819WS  [SOD-323_L1.8-W1.3-LS2.5-RD]  37.67 36.85 90 top
F1  BSMD0805-100-6V  [F0805]  33.86 16.72 90 top
H1  PZ254V-11-08P  [HDR-TH_8P-P2.54-V-M]  54.82 42.88 0 top
H2  PZ254V-11-08P  [HDR-TH_8P-P2.54-V-M]  54.82 40.34 0 top
H3  PZ254V-11-08P  [HDR-TH_8P-P2.54-V-M]  54.82 7.2 0 top
H4  PZ254V-11-08P  [HDR-TH_8P-P2.54-V-M]  54.82 37.8 0 top
H6  KH-2.54PH180-1X4P-L11.5  [HDR-TH_4P-P2.54-V-M]  40.08 33.85 90 top
H8  PZ254V-11-08P  [HDR-TH_8P-P2.54-V-M]  54.82 2.12 0 top
H9  PZ254V-11-08P  [HDR-TH_8P-P2.54-V-M]  54.82 4.66 0 top
H11  KH-2.54PH180-1X4P-L11.5  [HDR-TH_4P-P2.54-V-M]  40.08 11.15 270 top
H12  KH-2.54PH180-1X4P-L11.5  [HDR-TH_4P-P2.54-V-M]  43.89 22.5 90 top
KEY  TS24CA  [SW-SMD_TS24CA]  2 31.5 90 top
L1  1uH  [IND-SMD_L4.4-W4.2]  14.96 9.69 90 top
L2  2.2uH  [L1008]  29.67 17.61 0 top
MIC-L  PH2.0-2P  [CONN-TH_2P-P2.00_BOSSIE_BX-PH2.0-2PZZ]  22.55 41.5 180 top
MIC-R  PH2.0-2P  [CONN-TH_2P-P2.00_BOSSIE_BX-PH2.0-2PZZ]  29.09 41.5 180 top
NOREF  -  [Pad_e754]  52.78 21 0 top
NOREF#2  -  [Pad_e753]  52.78 24 0 top
NOREF#3  -  [Pad_e748]  50.24 21 0 top
NOREF#4  -  [Pad_e746]  50.24 27 0 top
NOREF#5  -  [Pad_e752]  52.78 27 0 top
NOREF#6  -  [Pad_e1433]  3 3 0 top
NOREF#7  -  [Pad_e750]  50.24 15.01 0 top
NOREF#8  -  [Pad_e755]  52.78 18 0 top
NOREF#9  -  [Pad_e749]  50.24 18 0 top
NOREF#10  -  [Pad_e756]  52.78 15.01 0 top
NOREF#11  -  [Pad_e751]  52.78 29.99 0 top
NOREF#12  -  [Pad_e747]  50.24 24 0 top
NOREF#13  -  [Pad_e1435]  69.8 42 0 top
NOREF#14  -  [Pad_e1436]  69.8 3 0 top
NOREF#15  -  [Pad_e745]  50.24 29.99 0 top
NOREF#16  -  [Pad_e1434]  3 42 0 top
POWER  TS24CA  [SW-SMD_TS24CA]  2 13.5 90 top
R3  10K  [R0603]  5.15 14.63 0 top
R4  500mΩ  [R0603]  11.89 10.69 90 top
R5  68Ω  [R1210]  34.62 12.02 270 top
R7  33.2kΩ  [R0603]  27 11.89 180 top
R8  150kΩ  [R0603]  27 10.37 0 top
R9  1.5K  [R0603]  14.94 3.83 180 top
R10  10K  [R0603]  67.91 37.25 180 top
R18  1.5K  [R0603]  67.52 11.07 180 top
R19  1.5K  [R0603]  67.52 9.55 180 top
R20  10K  [R0603]  44.27 14.43 90 top
R21  5.1K  [R0603]  5.15 16.33 180 top
R22  5.1K  [R0603]  6.43 28.72 180 top
R23  2.2K  [R0603]  23.11 36.2 90 top
R24  2.2K  [R0603]  25.08 36.2 270 top
R25  22K  [R0603]  37.54 32.79 270 top
R26  4.7K  [R0603]  34.75 29.16 270 top
R27  4.7R  [R0603]  22.68 20.98 270 top
R43  2.2K  [R0603]  26.81 36.2 270 top
R44  2.2K  [R0603]  28.65 36.2 90 top
R45  470R  [R0603]  32.4 24.91 180 top
R46  100R  [R0603]  32.46 26.5 180 top
R47  100R  [R0603]  29.67 20.91 270 top
R48  470R  [R0603]  31.32 20.91 270 top
R49  1.5K  [R0603]  6.43 32.59 180 top
R50  0  [R0603]  20.02 28.98 0 top
R51  0  [R0603]  20.02 30.5 0 top
R52  0  [R0603]  5.79 10.69 90 top
R53  0  [R0603]  7.32 10.69 90 top
R54  0  [R0603]  8.84 10.69 90 top
R55  0  [R0603]  10.37 10.69 90 top
RST  TS24CA  [SW-SMD_TS24CA]  2 37.5 90 top
Rx  XL-1608UGC-04  [LED0603-RD_GREEN]  67.01 7.77 0 top
SPK  PH2.0-2P  [CONN-TH_2P-P2.00_BOSSIE_BX-PH2.0-2PZZ]  35.64 41.5 180 top
Tx  XL-1608UGC-04  [LED0603-RD_GREEN]  67.01 5.99 0 top
U1  ESP32-S3-WROOM-1(N16R8)  [WIRELM-SMD_ESP32-S3-WROOM-1]  55.88 22.5 270 top
U3  CI1303  [SSOP-24_L8.6-W3.9-P0.64-LS6.0-BL]  25.99 26.75 0 top
U5  8002A  [SOP-8_L4.9-W3.9-P1.27-LS6.0-BL]  33.99 34.75 0 top
U8  SMF6.0A  [SOD-123FL_L2.8-W1.8-LS3.8-RD]  20.91 21.03 90 top
U18  IP5306  [ESOP-8_L4.9-W3.9-P1.27-LS6.0-BL-EP]  14.33 16.54 180 top
U19  TLV62568DBVR  [SOT-23-5_L3.0-W1.7-P0.95-LS2.8-BR]  27.38 14.37 0 top
USB1  -  [USB-C-SMD_G-SWITCH_GT-USB-7010EN]  3.8 22.5 270 top

## Footprints (pads in the part's own frame, mm; a bottom-side part is the same pattern mirrored in y, then rotated)
C0603
  rect 0.8x0.9 smd: 1(-0.7,0) 2(0.7,0)
C0805
  rect 1.41x1.35 smd: 1(-1,0) 2(1,0)
CONN-TH_2P-P2.00_BOSSIE_BX-PH2.0-2PZZ
  rect 1.5x1.5 hole 0.9: 1(-1,0)
  round 1.5 hole 0.9: 2(1,0)
ESOP-8_L4.9-W3.9-P1.27-LS6.0-BL-EP
  rect 0.6x1.2 smd: 1(-1.905,-2.909) 2(-0.635,-2.909) 3(0.635,-2.909) 4(1.905,-2.909) 5(1.905,2.909) 6(0.635,2.909) 7(-0.635,2.909) 8(-1.905,2.909)
  rect 3.3x2.4 smd: 9(0,0)
F0805
  rect 1.335x1.5 smd: 1(-1.143,0) 2(1.143,0)
HDR-TH_4P-P2.54-V-M
  rect 1.7x1.7 hole 1.1: 1(-3.81,0)
  round 1.7 hole 1.1: 2(-1.27,0) 3(1.27,0) 4(3.81,0)
HDR-TH_8P-P2.54-V-M
  rect 1.5x1.5 hole 1: 1(-8.89,0)
  round 1.5 hole 1: 2(-6.35,0) 3(-3.81,0) 4(-1.27,0) 5(1.27,0) 6(3.81,0) 7(6.35,0) 8(8.89,0)
IND-SMD_L4.4-W4.2
  rect 1.4x2.12 smd: 1(2.028,0) 2(-2.028,0)
L1008
  rect 1.635x2.16 smd: 1(-1.167,0) 2(1.167,0)
LED0603-RD_GREEN
  rect 0.8x0.8 smd: 1(-0.799,-0.004) 2(0.799,0.004)
Pad_e745
  round 2 smd far side: 1(0,0)
Pad_e746
  round 2 smd far side: 1(0,0)
Pad_e747
  round 2 smd far side: 1(0,0)
Pad_e748
  round 2 smd far side: 1(0,0)
Pad_e749
  round 2 smd far side: 1(0,0)
Pad_e750
  round 2 smd far side: 1(0,0)
Pad_e751
  round 2 smd far side: 1(0,0)
Pad_e752
  round 2 smd far side: 1(0,0)
Pad_e753
  round 2 smd far side: 1(0,0)
Pad_e754
  round 2 smd far side: 1(0,0)
Pad_e755
  round 2 smd far side: 1(0,0)
Pad_e756
  round 2 smd far side: 1(0,0)
Pad_e1433
  round 1.524 hole 2: 41(0,0)
Pad_e1434
  round 1.524 hole 2: 41(0,0)
Pad_e1435
  round 1.524 hole 2: 41(0,0)
Pad_e1436
  round 1.524 hole 2: 41(0,0)
R0603
  rect 0.806x0.864 smd: 1(-0.753,0) 2(0.753,0)
R1210
  rect 1.282x2.808 smd: 1(-1.441,0) 2(1.441,0)
SOD-123FL_L2.8-W1.8-LS3.8-RD
  rect 0.93x1.2 smd: 1(-1.6,0) 2(1.6,0)
SOD-323_L1.8-W1.3-LS2.5-RD
  rect 1x0.75 smd: 1(-1.173,0) 2(1.173,0)
SOP-8_L4.9-W3.9-P1.27-LS6.0-BL
  oval 0.63x1.865 smd: 1(-1.905,-2.683) 2(-0.635,-2.683) 3(0.635,-2.683) 4(1.905,-2.683) 5(1.905,2.683) 6(0.635,2.683) 7(-0.635,2.683) 8(-1.905,2.683)
SOT-23-5_L3.0-W1.7-P0.95-LS2.8-BR
  rect 1.1x0.6 smd: 1(1.3,-0.95) 2(1.3,0) 3(1.3,0.95) 4(-1.3,0.95) 5(-1.3,-0.95)
SSOP-24_L8.6-W3.9-P0.64-LS6.0-BL
  oval 0.35x1.878 smd: 1(-3.493,-2.627) 2(-2.857,-2.627) 3(-2.223,-2.627) 4(-1.587,-2.627) 5(-0.953,-2.627) 6(-0.318,-2.627) 7(0.318,-2.627) 8(0.953,-2.627) 9(1.587,-2.627) 10(2.223,-2.627) 11(2.857,-2.627) 12(3.493,-2.627) 13(3.493,2.627) 14(2.857,2.627) 15(2.223,2.627) 16(1.587,2.627) 17(0.953,2.627) 18(0.318,2.627) 19(-0.318,2.627) 20(-0.953,2.627) 21(-1.587,2.627) 22(-2.223,2.627) 23(-2.857,2.627) 24(-3.493,2.627)
SW-SMD_TS24CA
  rect 0.9x1.2 smd: 1(-2.3,0.775) 2(2.3,0.775)
  rect 1.2x1.3 smd: 3(-1.675,-0.775) 4(1.675,-0.775)
USB-C-SMD_G-SWITCH_GT-USB-7010EN
  oval 1x2.1 hole 0.6x1.7: 1(-4.32,1.802) 2(4.32,1.802)
  oval 1x1.6 hole 0.6x1.3: 3(4.32,-2.377) 4(-4.32,-2.377)
  rect 0.6x1.15 smd: A1B12(-3.2,2.377) A4B9(-2.4,2.377) B1A12(3.2,2.377) B4A9(2.4,2.377)
  rect 0.3x1.15 smd: A5(-1.25,2.377) A6(-0.25,2.377) A7(0.25,2.377) A8(1.25,2.377) B5(1.75,2.377) B6(0.75,2.377) B7(-0.75,2.377) B8(-1.75,2.377)
WIRELM-SMD_ESP32-S3-WROOM-1
  rect 1.5x0.9 smd: 1(-8.75,8.895) 2(-8.75,7.625) 3(-8.75,6.355) 4(-8.75,5.085) 5(-8.75,3.815) 6(-8.75,2.545) 7(-8.75,1.275) 8(-8.75,0.005) 9(-8.75,-1.265) 10(-8.75,-2.535) 11(-8.75,-3.805) 12(-8.75,-5.075) 13(-8.75,-6.345) 14(-8.75,-7.615) 27(8.75,-7.615) 28(8.75,-6.345) 29(8.75,-5.075) 30(8.75,-3.805) 31(8.75,-2.535) 32(8.75,-1.265) 33(8.75,0.005) 34(8.75,1.275) 35(8.75,2.545) 36(8.75,3.815) 37(8.75,5.085) 38(8.75,6.355) 39(8.75,7.625) 40(8.75,8.895)
  rect 0.9x1.5 smd: 15(-6.985,-8.895) 16(-5.715,-8.895) 17(-4.445,-8.895) 18(-3.175,-8.895) 19(-1.905,-8.895) 20(-0.635,-8.895) 21(0.635,-8.895) 22(1.905,-8.895) 23(3.175,-8.895) 24(4.445,-8.895) 25(5.715,-8.895) 26(6.985,-8.865)
  rect 0.9x0.9 smd: 41(-2.9,2.575) 41(-2.9,1.175) 41(-2.9,-0.225) 41(-1.5,2.575) 41(-1.5,1.175) 41(-1.5,-0.225) 41(-0.1,2.575) 41(-0.1,1.175) 41(-0.1,-0.225)

## Nets
As in the schematic, except:
GPIO3: NOREF#15.1 U1.15
GPIO13: NOREF#4.1 U1.21
GPIO14: NOREF#5.1 U1.22
GPIO21: NOREF#12.1 U1.23
GPIO35: NOREF#9.1 U1.28
GPIO36: NOREF#7.1 U1.29
GPIO37: NOREF#10.1 U1.30
GPIO38: NOREF#8.1 U1.31
GPIO45: NOREF.1 U1.26
GPIO46: NOREF#11.1 U1.16
GPIO47: NOREF#2.1 U1.24
GPIO48: NOREF#3.1 U1.25

Pads without a net: NOREF#6 41; NOREF#13 41; NOREF#14 41; NOREF#16 41; U3 6 7 11 12 13; USB1 A8 B8

## Via types
v1: diameter 0.61, hole 0.305, Top Layer to Bottom Layer, 243 vias

## Routing (per net, layer and track width the routed paths; a pad name or vN(x,y) marks a point on that pad's centre or on a via; arc(x,y) is an arc through that point)
3V3: length 94.3
  Top Layer w0.254: R19.2 66.76,11.06 v1(66.75,11.07) ; R20.2 45.55,16.45 45.55,19.58 H12.2 ; U1.2 v1(63.51,29.48)
  Top Layer w0.762: U1.2 63.51,35 65.23,36.72 v1(65.23,37.22) 65.23,39.39 64.28,40.34 H2.8 H2.7 H2.6 H2.5 H2.4 H2.3 H2.2 H2.1 ; H12.2 37.26,21.23 33.89,17.86 F1.2
  Bottom Layer w0.254: v1(67.16,37.25) 67.13,37.22 v1(65.23,37.22) ; v1(63.51,29.48) 66.75,26.24 v1(66.75,11.07)
  Bottom Layer w0.762: H2.1 44.85,40.34 43.89,39.38 43.89,28.98 45.67,27.2 45.67,23.01 H12.2
+5V_USB: length 37.9
  Top Layer w0.254: v1(10.11,24.91) 6.19,24.91 USB1.A4B9 ; v1(17.61,21.61) 16.97,21.61 16.23,20.87 U18.1
  Bottom Layer w0.254: 5V(USB).2 23.55,5.51 22.43,6.62 20.02,6.62 17.61,9.04 v1(17.61,21.61) ; v1(7.23,32.59) 7.23,30.34 10.11,27.45 v1(10.11,24.91)
AGND: length 17.1
  Top Layer w0.254: C16.1 20.53,26.56 20.77,26.81 R50.2 ; v1(21.67,30.88) 22.49,30.06 U3.24 v1(21.85,29.38)
  Top Layer w0.508: v1(21.67,30.88) 21.29,30.5 R51.2 ; v1(29.44,32.84) 29.44,32.84 29.44,32.76 29.8,32.41 29.8,31.89 C14.2 ; 21.85,28.6 v1(21.85,29.38) ; 21.85,28.6 v1(21.94,28.52) ; 21.85,28.6 21.48,28.98 R50.2
  Top Layer w0.635: v1(25.1,37.99) 25.1,36.97 R24.1 ; C18.1 21.63,35.1 v1(21.63,34.44) 21.63,33.88 C17.1 ; R43.1 v1(26.81,38.12)
  vias: v1(21.8,30.12) v1(22.05,37.87) v1(24.2,32.84) v1(24.33,34.44) v1(25.99,38.3) v1(25.99,36.25) v1(25.99,34.44) v1(25.99,32.84) v1(27.74,34.44) v1(27.74,32.84) v1(29.54,37.99)
GND: length 63.4
  Top Layer w0.254: KEY.1 2.15,29.2 2.77,29.83 ; U1.41 U1.41 ; U1.41 U1.41 ; U1.41 v1(57.05,24) ; v1(57.05,24) 55.65,24 55.65,25.4 ; v1(57.05,24) 57.05,25.4 57.75,25.4 ; v1(57.05,24) 57.05,22.6 55.65,22.6 ; R9.1 19.95,3.83 20.28,3.5 5V(USB).1 ; U8.2 v1(21.92,22.63) ; 2.77,5.83 v1(2.77,7.13)
  Top Layer w0.381: U1.41 v1(59.39,24) ; 57.05,25.4 57.1,25.45 v1(57.1,26.56) ; v1(26.94,26.31) v1(26.94,25.56) U3.8 ; v1(25.03,26.31) v1(25.03,25.56) U3.5 ; R21.1 5.65,16.58 5.65,18.13 5.6,18.18 ; U1.41 v1(59.52,22.6) ; 55.65,25.4 v1(55.65,26.56) ; 2.77,5.83 2.15,5.2 BOOT.1 ; 55.65,22.6 v1(55.65,21.61) ; USB1.4 1.22,27.02 KEY.1 ; RST.2 v1(1.22,40.66) ; C11.1 v1(67.21,39.9) ; KEY.2 RST.1 2.15,35.2 2.87,35.92 v1(2.87,37.23) ; 55.65,24 v1(54.69,24) ; 64.77,31.25 v1(65.86,31.25) ; v1(57.1,21.61) 57.1,22.55 57.05,22.6 ; 64.77,13.75 v1(64.77,15.13) ; U1.41 v1(58.45,26.56)
  Top Layer w0.508: 7.41,30.63 7.41,29.57 7.18,29.35 R22.1 7.18,27.83 6.18,26.82 USB1.1
  Top Layer w0.635: C31.2 v1(30.43,37.69) v1(30.43,38.44) v1(30.43,39.14) ; C21.2 C20.2 C19.2 ; v1(34.5,39.64) v1(33.99,39.14) v1(33.35,38.5) U5.7
  vias: v1(7.06,18.69) v1(7.06,16.91) v1(7.19,15.64) v1(7.32,34.44) v1(7.32,27.2) v1(7.44,17.8) v1(7.57,26.44) v1(7.77,18.69) v1(7.83,16.4) v1(7.95,34.95) v1(8.08,34.18) v1(8.08,27.45) v1(8.16,15.64) v1(8.33,28.09) v1(8.46,18.18) v1(8.54,26.82) v1(8.59,26.06) v1(8.96,27.45) v1(9.39,26.82) v1(9.39,26.06) v1(11.78,17.89) v1(11.78,17.05) v1(11.78,16.14) v1(11.78,15.22) v1(13.4,16.54) v1(13.92,17.29) v1(13.92,15.9) v1(14.33,16.54) v1(14.86,17.29) v1(14.86,15.9) v1(15.23,16.54) v1(16.46,16.07) v1(16.72,17.93) v1(16.72,17.06) v1(16.84,4.21) v1(17.1,3.32) v1(17.61,3.96) v1(17.92,3.32) v1(18.49,3.96) v1(18.62,19.07) v1(18.75,21.36) v1(18.75,19.96) v1(18.76,3.32) v1(18.87,18.06) v1(19.27,3.96) v1(19.51,20.34) v1(19.51,19.07) v1(19.71,21.36) v1(19.77,3.32) v1(19.87,18.06) v1(20.19,3.96) v1(20.55,10.39) v1(20.59,8.11) v1(20.85,18.06) v1(20.91,21.36) v1(21.8,17.55) v1(21.92,7.89) v1(22.05,27.2) v1(22.56,26.18) v1(23.32,26.95) v1(23.57,25.93) v1(24.34,26.95) v1(24.97,18.18) v1(25.1,3.96) v1(25.23,17.29) v1(25.37,26.95) v1(25.35,16.53) v1(25.55,3.18) v1(25.7,18.18) v1(25.89,17.29) v1(25.94,3.96) v1(26.04,16.4) v1(26.37,3.18) v1(26.53,18.18) v1(26.64,17.29) v1(26.74,3.96) v1(26.81,16.4) v1(28.4,26.06) v1(29.42,25.67) v1(32.46,34.44) v1(32.46,23.01) v1(32.87,33.68) v1(33.1,4.09) v1(33.1,3.18) v1(33.48,23.39) v1(33.48,22.6) v1(33.51,34.44) v1(33.73,21.48) v1(33.82,33.68) v1(34.47,34.44) v1(34.75,24.02) v1(34.75,22.97) v1(34.88,35.2) v1(34.88,33.68) v1(35.4,34.31) v1(35.61,24.79) v1(35.89,23.77) v1(36.53,25.67) v1(36.91,24.79) v1(37.12,26.31) v1(37.8,25.42) v1(38.06,27.2) v1(38.56,26.31) v1(38.69,27.83) v1(39.2,27.2) v1(39.7,41.8) v1(39.83,40.28) v1(40.45,41.42) v1(40.67,40.28) v1(41.2,41.8) v1(41.35,40.79) v1(41.61,39.39) v1(42.12,30.75) v1(42.24,41.42) v1(42.34,34.44) v1(42.37,33.42) v1(42.5,31.77) v1(56.98,19.07) v1(57.48,17.29) v1(58.56,18.44) v1(59.32,19.68) v1(59.32,16.35) v1(60.02,17.67) v1(60.91,16.15) v1(61.29,26.18) v1(61.29,18.44) v1(61.67,21.23) v1(61.67,19.71) v1(61.8,25.17) v1(62.19,22.5) v1(62.18,17.55) v1(62.69,25.8) v1(63.07,24.41) v1(63.07,20.21) v1(63.33,21.61) v1(68.53,24.02) v1(70.44,36.47) v1(70.69,12.72) v1(70.69,11.77) v1(70.69,9.67) v1(70.69,8.82) v1(70.69,7.56) v1(70.82,32.28) v1(70.95,38.88) v1(70.95,10.69) v1(71.45,37.87) v1(71.58,12.59) v1(71.58,11.44)
VCC: length 51.2
  Top Layer w0.254: U19.1 27.5,13.42 27.26,13.67 27.26,14.15 U19.4 ; v1(37.67,34.79) D26.1
  Top Layer w0.635: 20.91,19.43 v1(22.01,19.43) v1(22.68,19.43) ; C7.2 23.97,14.95 24.21,15.19 24.21,17.1 22.68,18.62 v1(22.68,19.43) ; v1(30.43,33.3) v1(30.43,33.98) v1(30.43,34.66) C31.1 33.92,35.57 34.62,36.27 v1(34.62,37.43) ; v1(22.68,19.43) R27.2
  Top Layer w1.27: H11.4 H11.3 H11.2
  Bottom Layer w0.254: v1(37.67,34.79) 35.03,37.43 v1(34.62,37.43)
  Bottom Layer w0.635: v1(22.01,19.43) 22.92,19.43 27.77,24.28 29.29,24.28 31.7,26.69 31.7,32.66 31.07,33.3 v1(30.43,33.3)
VIN5V: length 3.9
  Top Layer w0.381: C21.1 24.14,21.61 23.13,22.62 22.68,22.18 R27.1 ; U3.2 23.13,22.88
BAT: length 2.5
  Top Layer w0.254: D5.1 14.14,6.84 L1.2
FB: length 8.1
  Top Layer w0.254: C32.1 30.12,11.13 26.26,11.13 26.25,11.14 ; U19.5 26.08,12.81 26.25,12.64 R7.2 26.25,11.14 ; 26.25,11.14 R8.1
GPIO0: length 108.4
  Top Layer w0.254: v1(3.89,9.17) 3.88,9.17 2.77,9.17 ; v1(44.27,13.68) 44.35,13.75 U1.27
  Bottom Layer w0.254: 44.27,13.61 44.02,13.36 44.02,6.62 44.78,5.86 64.72,5.86 65.86,4.72 65.86,1.29 65.11,0.54 5.2,0.54 4.47,1.27 4.47,8.58 v1(3.89,9.17)
GPIO1: length 8.8
  Top Layer w0.254: U1.39 v1(63.51,12.09)
  Bottom Layer w0.254: H3.6 58.63,7.65 63.06,12.09 v1(63.51,12.09)
GPIO2: length 9.8
  Top Layer w0.254: U1.38 v1(62.23,12.09)
  Bottom Layer w0.254: v1(62.23,12.09) 58.55,8.4 57.29,8.4 H3.5
GPIO3: length 3.6
  Top Layer w0.254: U1.15 49.86,29.48 v1(50.37,29.99)
GPIO4: length 78.4
  Top Layer w0.254: v1(63.12,36.08) 60.96,33.92 U1.4 ; 2.77,33.17 2.77,33.96 8.46,39.64 v1(8.46,40.03)
  Bottom Layer w0.254: v1(63.12,36.08) 62.44,36.76 62.44,43.36 61.77,44.03 12.46,44.03 v1(8.46,40.03)
GPIO5: length 8.2
  Top Layer w0.254: U1.5 59.7,33.79 H4.8
GPIO6: length 7.7
  Top Layer w0.254: U1.6 58.42,35.06 H4.7
GPIO7: length 7.2
  Top Layer w0.254: 57.15,31.25 57.15,36.33 H4.6
GPIO8: length 8.6
  Top Layer w0.254: H4.1 50.8,32.92 U1.12
GPIO9: length 19.5
  Top Layer w0.254: U1.17 46.05,26.95 44.78,28.22 42.88,28.22 34.82,20.15 R48.2
GPIO10: length 22.9
  Top Layer w0.254: R47.2 29.67,19.64 30.05,19.26 34.43,19.26 43.01,27.83 44.66,27.83 45.42,27.07 45.42,26.31 46.05,25.67 U1.18
GPIO11: length 3.9
  Top Layer w0.254: U1.19 45.8,24.41 H12.4
GPIO12: length 3.4
  Top Layer w0.254: U1.20 44.53,23.14 H12.3
GPIO13: length 6.9
  Top Layer w0.254: U1.21 47.83,21.86 48.47,22.5 48.47,25.17 v1(50.24,26.95)
GPIO14: length 9.9
  Top Layer w0.254: U1.22 47.96,20.59 49.1,21.74 49.1,24.28 50.37,25.55 51.39,25.55 v1(52.78,26.95)
GPIO15: length 6.6
  Top Layer w0.254: U1.8 56.09,31.45 H4.5
GPIO16: length 7
  Top Layer w0.254: H4.4 54.61,36.73 54.61,31.25
GPIO17: length 7.5
  Top Layer w0.254: H4.3 53.34,35.46 U1.10
GPIO18: length 8
  Top Layer w0.254: U1.11 52.08,34.19 H4.2
GPIO19: length 75.6
  Top Layer w0.254: U1.13 49.54,31.97 43.77,37.74 43.77,42.57 42.37,43.96 13.54,43.96 4.02,34.44 4.02,29.1 3,28.09 3,23.64 4.39,22.25 USB1.A7 6.94,22.25 7.06,22.37 7.06,23.14 6.95,23.25 USB1.B7
GPIO20: length 74.8
  Top Layer w0.254: USB1.A6 5.42,22.75 4.79,23.38 v1(4.8,23.39) 4.8,23.75 3.41,25.15 3.41,27.98 4.37,28.95 4.37,34.29 13.69,43.61 42.22,43.61 43.41,42.42 43.41,37.59 48.27,32.74 U1.14 ; USB1.B6 v1(3.63,21.75)
  Bottom Layer w0.254: v1(4.8,23.39) 3.63,22.22 v1(3.63,21.75)
GPIO21: length 6.3
  Top Layer w0.254: v1(50.12,24.02) 49.86,23.77 49.86,21.97 48.26,20.37 48.26,20.01 47.58,19.33 U1.23
GPIO35: length 4.6
  Top Layer w0.254: U1.28 49.54,16.85 50.24,17.56 v1(50.24,18.06)
GPIO36: length 1.5
  Top Layer w0.254: U1.29 50.8,14.45 v1(50.24,15.01)
GPIO37: length 1.7
  Top Layer w0.254: U1.30 52.08,14.42 v1(52.78,15.13)
GPIO38: length 5.1
  Top Layer w0.254: U1.31 53.34,14.42 54.05,15.13 54.05,16.78 v1(52.78,18.06)
GPIO39: length 12.5
  Top Layer w0.254: H3.1 47.01,7.2 48.4,8.59 51.38,8.59 54.61,11.82 54.61,13.75
GPIO40: length 10.8
  Top Layer w0.254: U1.33 55.89,12.58 51.53,8.23 50.58,8.23 49.55,7.2 H3.2
GPIO41: length 9.1
  Top Layer w0.254: H3.3 57.15,13.35 57.15,13.75
GPIO42: length 8.6
  Top Layer w0.254: H3.4 53.55,7.64 58.42,12.52 U1.35
GPIO45: length 8.9
  Top Layer w0.254: U1.26 47.31,15.52 49.46,17.66 49.46,19.2 51.23,20.98 v1(52.78,20.98)
GPIO46: length 6.5
  Top Layer w0.254: U1.16 51.01,28.22 v1(52.78,29.99)
GPIO47: length 8.8
  Top Layer w0.254: v1(52.78,24.02) 52.42,24.02 48.62,20.22 48.62,19.37 47.31,18.06 U1.24
GPIO48: length 6
  Top Layer w0.254: U1.25 47.83,16.78 49.1,18.06 49.1,19.83 v1(50.24,20.98)
HPOUT: length 8.1
  Top Layer w0.381: U3.17 26.94,30.37 27.38,30.81 29.92,30.81 30.57,30.16 30.57,28.53 30.84,28.26 31.65,28.26 C15.1
L+: length 9.7
  Top Layer w0.254: 21.55,41.55 21.55,41.16 22.68,40.03 23.32,40.03 23.83,39.52 23.83,36.17 23.07,35.41 23.07,34.88 23.31,34.63 C12.2
L-: length 8.5
  Top Layer w0.254: 23.55,41.02 23.85,41.02 24.21,40.66 24.21,36.02 24.78,35.45 R24.2 25.04,35.44 25.08,35.4 25.08,33.55
  Top Layer w0.381: 25.08,33.55 C13.2
MCU_EN: length 87.8
  Top Layer w0.254: 2.77,39.17 6.47,39.17 11.64,44.34 64.98,44.34 v1(65.23,44.09) ; U1.3 62.23,29.43 62.82,28.85 65.23,28.85 68.66,32.28 68.66,39.9 v1(67.61,40.95)
  Bottom Layer w0.254: v1(65.23,44.09) 67.61,41.71 v1(67.61,40.95)
MCUCC1: length 7.9
  Top Layer w0.254: USB1.A5 5.31,23.75 3.76,25.29 3.76,27.83 4.65,28.72 R22.2
MCUCC2: length 6.7
  Top Layer w0.254: 4.14,16.33 4.14,17.04 3.51,17.67 3.51,19.71 4.55,20.75 USB1.B5
MICBIAS: length 19.5
  Top Layer w0.254: v1(28.68,39.03) 28.68,36.98 R44.2 ; 22.18,36.15 21.48,36.85 C18.2 ; 22.18,36.15 22.3,36.02 22.3,33.17 22.56,32.91 22.56,31.64 23.76,30.43 U3.22 ; 22.18,36.15 23.13,37.1 v1(23.13,38.96)
  Bottom Layer w0.254: v1(28.68,39.03) 28.61,38.96 v1(23.13,38.96)
MICNL: length 2.8
  Top Layer w0.254: C13.1 25.03,32.09 U3.20
MICNR: length 3.3
  Top Layer w0.254: C30.1 26.86,31.81 25.67,30.62 U3.19
MICPL: length 3.4
  Top Layer w0.254: 23.13,32.14 23.39,32.14 24.4,31.13 U3.21
MICPR: length 4.3
  Top Layer w0.254: C29.1 27.94,31.45 27,31.45 26.3,30.75 U3.18
MUTE: length 10.5
  Top Layer w0.254: v1(30.69,32.07) 30.99,31.77 31.78,31.77 U5.1 ; U3.16 v1(27.57,27.64)
  Bottom Layer w0.254: v1(30.69,32.07) 30.69,28.34 29.98,27.64 v1(27.57,27.64)
OUT: length 8.8
  Top Layer w0.254: v1(29.56,10.45) 29.54,10.43 29.42,10.43 29.35,10.37 R8.2 ; v1(32.08,15.19) 32.02,15.19 31.99,15.16 C33.2
  Bottom Layer w0.254: v1(32.08,15.19) 32.08,12.98 v1(29.56,10.45)
R+: length 9.6
  Top Layer w0.254: 30.09,41.42 29.05,40.38 28.43,40.38 27.94,39.88 27.94,36.16 R44.1 28.63,35.43 C29.2 ; 30.09,41.69 MIC-R.1
R-: length 8.4
  Top Layer w0.254: C30.2 26.86,35.39 R43.2 27.51,36.15 27.51,36.43 27.52,36.44 27.52,37.47 27.51,37.48 27.51,40.83 28.09,41.42
RX0: length 9.1
  Top Layer w0.254: H6.1 38.86,30.04 33.73,24.91 R45.1
SPK+: length 4.9
  Top Layer w0.635: U5.8 32.08,38.76 34.64,41.31
SPK-: length 9
  Top Layer w0.635: SPK.1 36.64,39.63 35.89,38.88 U5.5 35.89,35.19 R25.1
TX0: length 9.8
  Top Layer w0.254: H6.2 38.43,30.93 38.43,30.25 34.68,26.5 R46.1
U0RXD: length 13
  Top Layer w0.254: H3.7 59.7,8.67 U1.36
  Bottom Layer w0.254: H3.7 62.37,8.4 65.61,8.4 v1(66.25,7.77)
U0TXD: length 10.8
  Top Layer w0.254: 66.21,5.74 64.74,7.2 H3.8 60.96,9.94 U1.37
$1N2534: length 3.5
  Top Layer w0.635: C14.1 33.16,30.69 33.35,30.88 U5.2 U5.3
$1N2536: length 4.2
  Top Layer w0.635: R26.1 35.89,31.06 U5.4 37.51,32.07
$1N2540: length 1.7
  Top Layer w0.635: C15.2 34.49,28.15 R26.2
$1N2554: length 2.1
  Top Layer w0.254: C16.2 20.93,24.12 U3.1
$1N2563: length 3.7
  Top Layer w0.254: C17.2 21.56,32.13 23.13,30.56 U3.23
$1N2581: length 5.9
  Top Layer w0.254: U3.15 28.21,28.34 R45.2
$1N2584: length 4.7
  Top Layer w0.254: R46.2 30.56,26.5 28.84,28.21 U3.14
$1N2587: length 4.1
  Top Layer w0.254: U3.9 27.57,22.49 27.64,22.43 28.9,22.43 R47.1
$1N2590: length 4.8
  Top Layer w0.254: U3.10 28.21,22.97 28.39,22.79 29.05,22.79 29.41,22.42 30.56,22.42 R48.1
$1N2601: length 5.2
  Top Layer w0.254: C19.1 27.36,21.61 26.32,22.64 24.72,22.64 24.4,22.96 U3.4
$1N2603: length 4
  Top Layer w0.254: U3.3 23.76,23 24.48,22.29 24.9,22.29 25.58,21.61 C20.1
$1N27240: length 2
  Top Layer w0.254: R49.2 5.68,30.66 5.7,30.63
$1N94139: length 6.8
  Top Layer w0.254: C9.2 9.98,13.35 R4.2 13.69,13.24 U18.6
$1N94145: length 16.6
  Top Layer w0.254: D2.2 15.74,25.86 16.59,25.86 17.02,25.43 17.02,23.41 16.77,23.15 D1.1 ; D2.2 13.03,23.15 v1(12.93,23.15) ; D2.2 14.63,25.02 13.8,25.86 12.32,25.86 D4.2
  Bottom Layer w0.254: v1(12.42,19.45) 12.93,19.96 v1(12.93,23.15)
$1N94146: length 6.2
  Top Layer w0.254: D1.2 14.74,23.15 D2.1
  Bottom Layer w0.254: v1(14.96,19.45) 14.63,19.78 v1(14.63,23.15)
$1N94147: length 8
  Top Layer w0.254: D3.2 11.32,23.15 D4.1
  Bottom Layer w0.254: v1(12.92,24.75) 13.69,23.98 v1(13.69,19.45)
$1N94153: length 7
  Top Layer w0.254: 34.62,10.58 34.71,10.49 35.32,10.49 39.45,14.63 39.83,14.63
$1N94164: length 6.9
  Top Layer w0.254: U18.5 v1(11.25,13.64)
  Bottom Layer w0.254: v1(5.96,14.63) 10.26,14.63 v1(11.25,13.64)
$1N97678: length 7
  Top Layer w0.254: 67.91,5.74 69.42,7.25 69.42,10.82 69.17,11.07 R18.1
$1N97724: length 1.9
  Top Layer w0.254: R19.1 68.27,8.13 67.91,7.77
$1N97763: length 2.3
  Top Layer w0.254: R3.1 3.51,14.63 2.59,15.54 2.5,15.54
$1N97802: length 2.3
  Top Layer w0.254: D5.2 15.74,5.38 R9.2
$1N103126: length 4.1
  Top Layer w0.254: D26.2 37.67,37.23 39.78,35.12 H6.3

## Copper pours and planes (outline as drawn; the poured copper is in the pictures)
+5V_USB on Top Layer: 6.02,25.42 17.1,25.42 17.1,18.76 6.02,18.76
AGND on Top Layer: 20.02,45.11 38.43,45.11 38.43,27.96 20.02,27.96
AGND on Bottom Layer: 21.16,38.5 29.8,38.5 29.8,28.34 21.16,28.34
DGND on Top Layer: 4.9,10.49 65.1,10.49 65.1,0.33 4.9,0.33
DGND on Bottom Layer: 4.91,10.49 65.1,10.49 65.1,1.04 4.91,1.04
GND on Top Layer: 0.21,45.23 19.64,45.23 19.64,27.96 37.29,27.96 38.89,29.56 38.89,45.36 72.84,45.36 73.1,0.02 0.21,0.02
GND on Bottom Layer: -0.05,45.11 72.98,45.11 72.98,-0.61 -0.05,-0.61
VCC on Top Layer: 15.83,15.82 65.1,15.82 65.1,3.41 15.83,3.41
VCC on Bottom Layer: 37.42,13.61 64.85,13.61 64.85,3.58 37.42,3.58
BAT on Top Layer: 11.34,10.45 39.83,10.45 39.83,2.62 11.34,2.62
OUT on Top Layer: 29.91,18.82 34.88,18.82 34.88,14.5 29.91,14.5
$1N94140 on Top Layer: 13.8,14.3 16.08,14.3 16.08,11 13.8,11
$1N94156 on Top Layer: 27.38,18.75 29.42,18.75 29.42,14.94 27.38,14.94

## Text on the board
Bottom Silkscreen Layer: + | - | MIC(L) | 5V(USB) | MIC(R) | BAT(OUT) | SPK | BAT(IN) | 3V3 | SDA(11) | CLK(12) | GND | Rx | 5V | Tx | ON/OFF | 8 | M1 | 39 | 3 | 13 | 21 | 18 | 36 | 35 | 48 | M2 | 40 | 17 | 41 | M3 | 16 | M4 | 42 | 14 | 46 | 38 | 37 | 47 | 45 | 2 | 15 | 1 | 7 | 6 | 44 | 5 | 43 | KEY | RST | BOOT | POWER | V2.1 | 舵机 | RYMCU--嵌入式知识学习交流平台 | www.rymcu.com | 潦草小狗 | 语音固件 | OLED I2C
Top Silkscreen Layer: V2.1 | CLK(12) | SDA(11) | 3V3 | GND | Tx | Rx | ON | 5V | 39 | M1 | 8 | 40 | M2 | 18 | M3 | 41 | 17 | M4 | 42 | 16 | 2 | 15 | 1 | 7 | 44 | 6 | 43 | 5 | 潦草小狗 | 舵机
